# Altium schematic sheet HV1.SchDoc
size A3
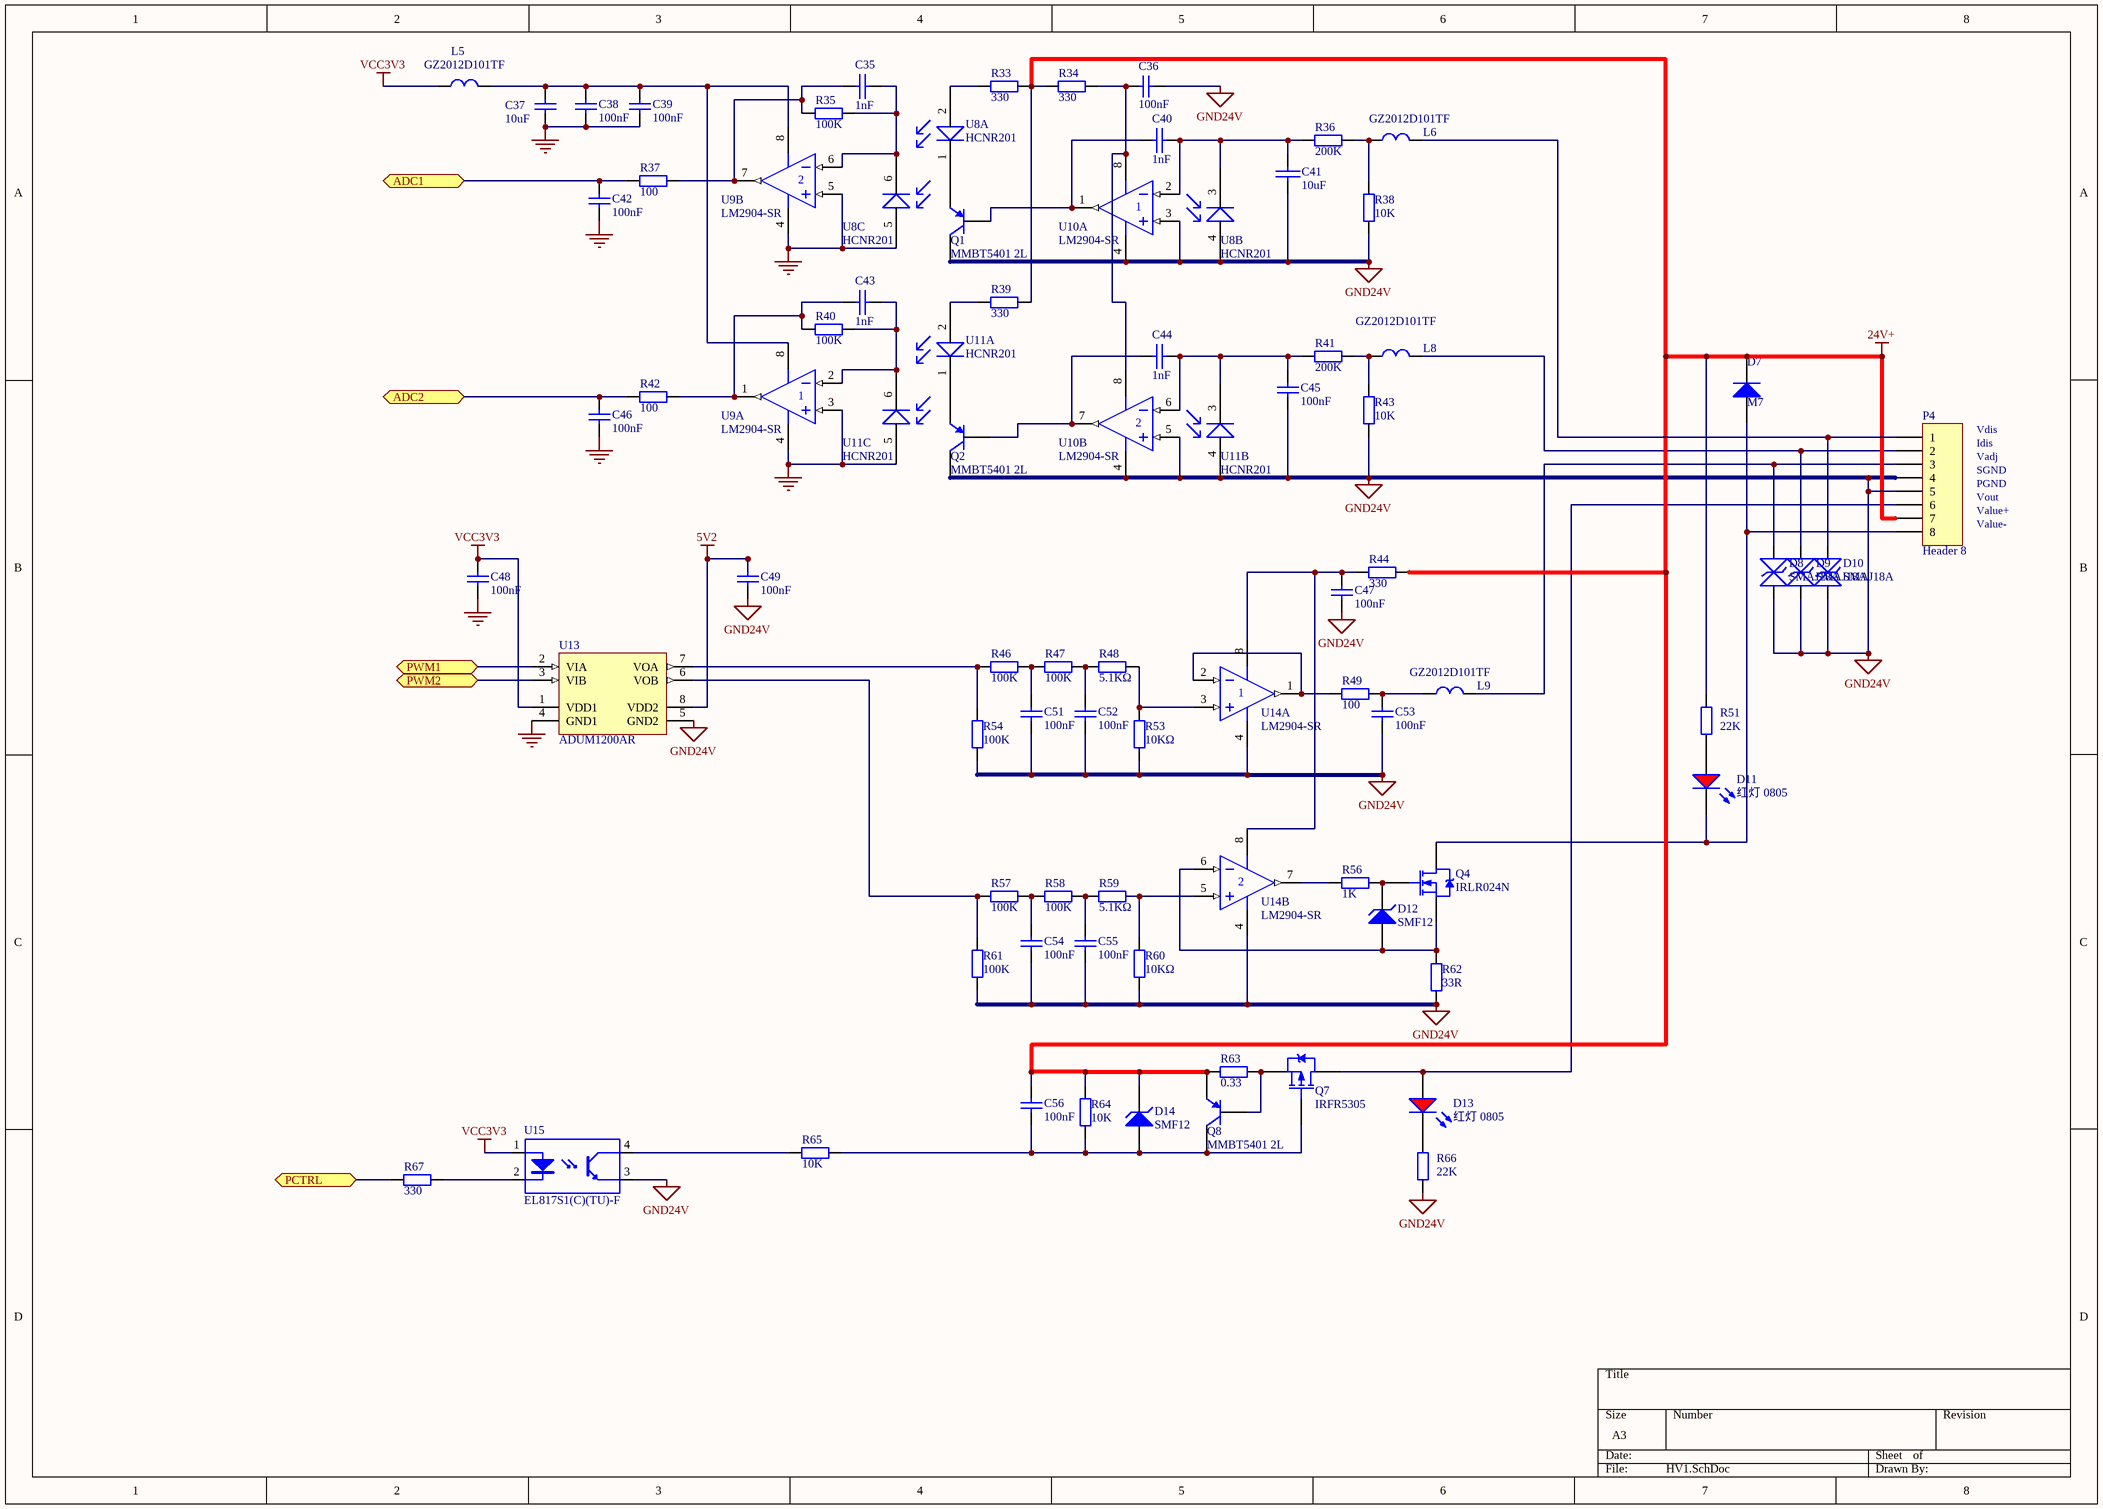
[diagram p0: HV1.SchDoc]

## Parts
C35  1nF  [0805_C]
C36  100nF  [0805_C]
C37  10uF  [0805_C]
C38  100nF  [0805_C]
C39  100nF  [0805_C]
C40  1nF  [0805_C]
C41  10uF  [0805_C]
C42  100nF  [0805_C]
C43  1nF  [0805_C]
C44  1nF  [0805_C]
C45  100nF  [0805_C]
C46  100nF  [0805_C]
C47  100nF  [0805_C]
C48  100nF  [0805_C]
C49  100nF  [0805_C]
C51  100nF  [0805_C]
C52  100nF  [0805_C]
C53  100nF  [0805_C]
C54  100nF  [0805_C]
C55  100nF  [0805_C]
C56  100nF  [0805_C]
D7  M7  [SMA(DO-214AC)_S1]
D8  SMAJ18A  [SMA]
D9  SMAJ18A  [SMA]
D10  SMAJ18A  [SMA]
D11  红灯 0805  [0805_LED_S1]
D12  SMF12  [SOD-123]
D13  红灯 0805  [0805_LED_S1]
D14  SMF12  [SOD-123]
L5  GZ2012D101TF  [0805_L]
L6  GZ2012D101TF  [0805_L]
L8  GZ2012D101TF  [0805_L]
L9  GZ2012D101TF  [0805_L]
P4  Header 8  [MC1.5/8-ST-3.81]
Q1  MMBT5401 2L  [SOT-23(SOT-23-3)]
Q2  MMBT5401 2L  [SOT-23(SOT-23-3)]
Q4  IRLR024N  [TO-252AA_N]
Q7  IRFR5305  [TO-252AA_N]
Q8  MMBT5401 2L  [SOT-23(SOT-23-3)]
R33  330  [0805_R]
R34  330  [0805_R]
R35  100K  [0805_R]
R36  200K  [0805_R]
R37  100  [0805_R]
R38  10K  [0805_R]
R39  330  [0805_R]
R40  100K  [0805_R]
R41  200K  [0805_R]
R42  100  [0805_R]
R43  10K  [0805_R]
R44  330  [0805_R]
R46  100K  [0805_R]
R47  100K  [0805_R]
R48  5.1KΩ  [0805_R]
R49  100  [0805_R]
R51  22K  [R0805]
R53  10KΩ  [0805_R]
R54  100K  [0805_R]
R56  1K  [0805_R]
R57  100K  [0805_R]
R58  100K  [0805_R]
R59  5.1KΩ  [0805_R]
R60  10KΩ  [0805_R]
R61  100K  [0805_R]
R62  33R  [R2512]
R63  0.33  [R2512]
R64  10K  [0805_R]
R65  10K  [0805_R]
R66  22K  [0805_R]
R67  330  [0805_R]
U8  HCNR201  [SMD-8_9.0mm]  (parts A,B,C of 3)
U9  LM2904-SR  [SOIC-8_150mil]  (parts A,B of 2)
U10  LM2904-SR  [SOIC-8_150mil]  (parts A,B of 2)
U11  HCNR201  [SMD-8_9.0mm]  (parts A,B,C of 3)
U13  ADUM1200AR  [ADI-R-8_N]
U14  LM2904-SR  [SOIC-8_150mil]  (parts A,B of 2)
U15  EL817S1(C)(TU)-F  [LC-SMD-4]

## Ports
ADC1, ADC2, PCTRL, PWM1, PWM2

## Nets
5V2: C49.2 U13.8(VDD2)
24V+: C56.2 D7.2(K) D14.2(K) P4.7 Q8.2(E) R33.1 R34.2 R39.1 R44.1 R51.1 R63.2 R64.2
GND: C37.1 C38.1 C39.1 C42.1 C46.1 C48.1 U8.5(+) U9.3(IN+) U9.4(V-) U9.5(IN+) U11.5(+) U13.4(GND1)
GND24V: C36.1 C41.1 C45.1 C47.1 C49.1 C51.1 C52.1 C53.1 C54.1 C55.1 D8.1 D9.1 D10.1 P4.4 P4.5 Q1.3(C) Q2.3(C) R38.1 R43.1 R53.2 R54.2 R60.2 R61.2 R62.1 R66.2 U8.4(+) U10.3(IN+) U10.4(V-) U10.5(IN+) U11.4(+) U13.5(GND2) U14.4(V-) U15.3(E)
VCC3V3: C48.2 L5.1 U13.1(VDD1) U15.1(A)
ADC1: C42.2 R37.2 ; port ADC1
ADC2: C46.2 R42.2 ; port ADC2
PCTRL: R67.1 ; port PCTRL
PWM1: U13.2(VIA) ; port PWM1
PWM2: U13.3(VIB) ; port PWM2
NetC35_1: C35.1 R35.2 U8.6(-) U9.6(IN-)
NetC35_2: C35.2 R35.1 R37.1 U9.7(OUT)
NetC36_2: C36.2 R34.1 U10.8(V+)
NetC37_2: C37.2 C38.2 C39.2 L5.2 U9.8(V+)
NetC40_1: C40.1 C41.2 R36.1 U8.3(-) U10.2(IN-)
NetC40_2: C40.2 Q1.1(B) U10.1(OUT)
NetC43_1: C43.1 R40.2 U9.2(IN-) U11.6(-)
NetC43_2: C43.2 R40.1 R42.1 U9.1(OUT)
NetC44_1: C44.1 C45.2 R41.1 U10.6(IN-) U11.3(-)
NetC44_2: C44.2 Q2.1(B) U10.7(OUT)
NetC47_2: C47.2 R44.2 U14.8(V+)
NetC51_2: C51.2 R46.1 R47.2
NetC52_2: C52.2 R47.1 R48.2
NetC53_2: C53.2 L9.2 R49.1
NetC54_2: C54.2 R57.1 R58.2
NetC55_2: C55.2 R58.1 R59.2
NetC56_1: C56.1 D14.1(A) Q7.1(G) Q8.3(C) R64.1 R65.1
NetD7_1: D7.1(A) D11.K P4.8 Q4.4(D)
NetD8_2: D8.2 L9.1 P4.3
NetD9_2: D9.2 L8.2 P4.2
NetD10_2: D10.2 L6.2 P4.1
NetD11_A: D11.A R51.2
NetD12_1: D12.1(A) Q4.3(S) R62.2 U14.6(IN-)
NetD12_2: D12.2(K) Q4.1(G) R56.1
NetD13_A: D13.A P4.6 Q7.4(D)
NetD13_K: D13.K R66.1
NetL6_1: L6.1 R36.2 R38.2
NetL8_1: L8.1 R41.2 R43.2
NetQ1_2: Q1.2(E) U8.1(-)
NetQ2_2: Q2.2(E) U11.1(-)
NetQ7_3: Q7.3(S) Q8.1(B) R63.1
NetR33_2: R33.2 U8.2(+)
NetR39_2: R39.2 U11.2(+)
NetR46_2: R46.2 R54.1 U13.7(VOA)
NetR48_1: R48.1 R53.1 U14.3(IN+)
NetR49_2: R49.2 U14.1(OUT) U14.2(IN-)
NetR56_2: R56.2 U14.7(OUT)
NetR57_2: R57.2 R61.1 U13.6(VOB)
NetR59_1: R59.1 R60.1 U14.5(IN+)
NetR65_2: R65.2 U15.4(C)
NetR67_2: R67.2 U15.2(K)

## Notes on the sheet
- Vdis
- Idis
- Vadj
- SGND
- PGND
- Vout
- Value+
- Value-

## Library data of the parts
C35 C40 C43 C44 = CAP: Capacitor
C36 C38 C39 C42 C45-C49 C51-C56 = 0805 100nF(104) 10% 50V: 贴片电容; ComponentLink1Description: 供应商链接; ComponentLink1URL: http://www.szlcsc.com/product/details_50686.html; Package: 0805; Supplier: LC; SuppliersPartNumber: C49678
C37 = 1206 10uF (106) 10% 50V: 贴片电容; ComponentLink1Description: 供应商链接; ComponentLink1URL: http://www.szlcsc.com/product/details_14236.html; Package: 1206; Supplier: LC; SuppliersPartNumber: C13585
C41 = CC: Capacitor
D7 = SMA(DO-214AC) M7: 二极管; 备注: 1N4007 4007 编号C2464 已经停售, 使用新物料编号C95872; ComponentLink1Description: 供应商链接; ComponentLink1URL: http://www.szlcsc.com/product/details_2841.html; Package: SMA(DO-214AC); Supplier: LC; SuppliersPartNumber: C95872
D8-D10 = TVS
D11 D13 = 0805 红灯: 发光二极管; ComponentLink1Description: 供应商链接; ComponentLink1URL: http://www.szlcsc.com/product/details_2668.html; Package: 0805; Supplier: LC; SuppliersPartNumber: C2295
D12 D14 = D Zener: Zener Diode; Published: 8-Jun-2000; LatestRevisionDate: 17-Jul-2002; LatestRevisionNote: Re-released for DXP Platform.; PackageReference: DIODE-0.7; Publisher: Altium Limited; PackageDescription: Diode, Thru-Hole; 2 Leads; 0.7 in Pin Spacing
L5 L6 L8 L9 = L1
P4 = Header 8: Header, 8-Pin; LatestRevisionDate: 17-Jul-2002; LatestRevisionNote: Re-released for DXP Platform.; Publisher: Altium Limited
Q1 Q2 Q8 = SOT-23 MMBT5401 2L: 三极管; ComponentLink1Description: 供应商链接; ComponentLink1URL: http://www.szlcsc.com/product/details_8818.html; Package: SOT-23; Supplier: LC; SuppliersPartNumber: C8326
Q4 = IRLR024N: HEXFET Power MOSFET; Note: Pin 2 is trimmed and is electrically connected to Drain.; Published: 8-Jun-2000; LatestRevisionDate: 20-Nov-2009; LatestRevisionNote: IPC-7351 Footprint Added.; PackageVersion: Feb-2003; PackageReference: TO-252AA; Publisher: Altium Limited; PackageDescription: 3-Pin HEXFET Package 2.28 mm Pitch, 9.9 mm Lead Span; Code_JEDEC: TO-252-AA; ComponentLink1Description: Manufacturer Link; ComponentLink1URL: http://www.irf.com/; ComponentLink2Description: Datasheet; ComponentLink2URL: http://www.irf.com/product-info/datasheets/data/irlr024n.pdf
Q7 = IRFR5305: HEXFET Power MOSFET; Note: Pin 2 is trimmed and is electrically connected to Drain.; Published: 8-Jun-2000; LatestRevisionDate: 20-Nov-2009; LatestRevisionNote: IPC-7351 Footprint Added.; DatasheetVersion: PD-9.1402; PackageReference: TO-252AA; Publisher: Altium Limited; PackageDescription: 3-Pin HEXFET Package 2.28 mm Pitch, 9.9 mm Lead Span; ComponentLink1Description: Manufacturer Link; ComponentLink1URL: http://www.irf.com/; ComponentLink2Description: Datasheet; ComponentLink2URL: http://www.irf.com/product-info/datasheets/data/irfr5305.pdf; PackageVersion: Feb-2003; Code_JEDEC: TO-252-AA
R33-R43 R62-R65 R67 = Res2: Resistor; Value: 1K; Published: 8-Jun-2000; LatestRevisionDate: 17-Jul-2002; LatestRevisionNote: Re-released for DXP Platform.; PackageReference: AXIAL-0.4; Publisher: Altium Limited
R44 = 0805 100Ω (1000) 1%: 贴片电阻; ComponentLink1Description: 供应商链接; ComponentLink1URL: http://www.szlcsc.com/product/details_18096.html; Package: 0805; Supplier: LC; SuppliersPartNumber: C17408
R46 R47 R49 R54 R56-R58 R61 = 0805 100KΩ (1003) 1%: 贴片电阻; ComponentLink1Description: 供应商链接; ComponentLink1URL: http://www.szlcsc.com/product/details_18095.html; Package: 0805; Supplier: LC; SuppliersPartNumber: C17407
R48 R59 = 0805 5.1KΩ (5101) 1%: 贴片电阻; ComponentLink1Description: 供应商链接; ComponentLink1URL: http://www.szlcsc.com/product/details_28584.html; Package: 0805; Supplier: LC; SuppliersPartNumber: C27834
R51 R66 = RMK2012KBxxx（10～1M）F: 贴片电阻; 质量保证等级: GJB; 技术规范: GJB1432A-99; 厂家: 718厂; VALUE: RMK2012KB102F
R53 R60 = 0805 10KΩ (1002) 1%: 贴片电阻; ComponentLink1Description: 供应商链接; ComponentLink1URL: http://www.szlcsc.com/product/details_18102.html; Package: 0805; Supplier: LC; SuppliersPartNumber: C17414
U9 U10 U14 = LM2904D: Dual Low-Power Operational Amplifier; Published: 17-Jul-2002; LatestRevisionDate: 13-Apr-2006; LatestRevisionNote: IPC-7351 Footprint Added.; DatasheetVersion: 1988; PackageReference: 751-02; Publisher: Altium Limited; PackageDescription: 8-Pin Small Outline Integrated Circuit 1.27 mm Pitch; Code_JEDEC: MS-012-AA; Code_IPC: SOIC127P600-8; ComponentLink1Description: Manufacturer Link; ComponentLink1URL: http://www.onsemi.com/site/products/parametrics/0,4446,251,00.html; ComponentLink2Description: Datasheet; ComponentLink2URL: http://www.onsemi.com/pub/Collateral/LM358-D.PDF
U13 = ADUM1200AR: Dual Channel Digital Isolator, 2.5 KV rms Insulation Rating, 1 Mbps Data Rate, 150 ns Delay, Industrial, 8-pin SOIC (R-8), Tube; Manufacturer: Analog Devices; Insulation Rating (kVrms): 2.5; Max Data Rate: 1Mbps; DatasheetVersion: Rev. I; PackageVersion: 060506-A, 06/2006; PackageReference: R-8; PackageDescription: 8-Pin Standard Small Outline Package, Body 4.9 x 3.9 mm, Pitch 1.27 mm; Supplier 1: Digi-Key; Supplier Part Number 1: ADUM1200AR-ND; Supplier 2: Mouser; Supplier Part Number 2: 584-ADUM1200AR; Max Operating Temp (degreesC): 125; Mounting Technology: Surface Mount; Code_JEDEC: MS-012-AA; PartNumber: ADUM1200AR; ComponentLink1Description: Manufacturer URL; ComponentLink1URL: http://www.analog.com/en/index.html; ComponentLink2Description: Datasheet; ComponentLink2URL: http://www.analog.com/static/imported-files/data_sheets/ADuM1200_1201.pdf; ComponentLink3Description: Package Specification; ComponentLink3URL: http://www.analog.com/static/imported-files/packages/PKG_PDF/SOIC_Narrow%20(R)/R_8.pdf; ComponentLink4Description: URL Link1; ComponentLink4URL: Product URL:http://www.analog.com/en/interface-isolation/digital-isolators/adum1200/products/product.html
U15 = TLP521: Text Field1: 80; Text Field2: 50